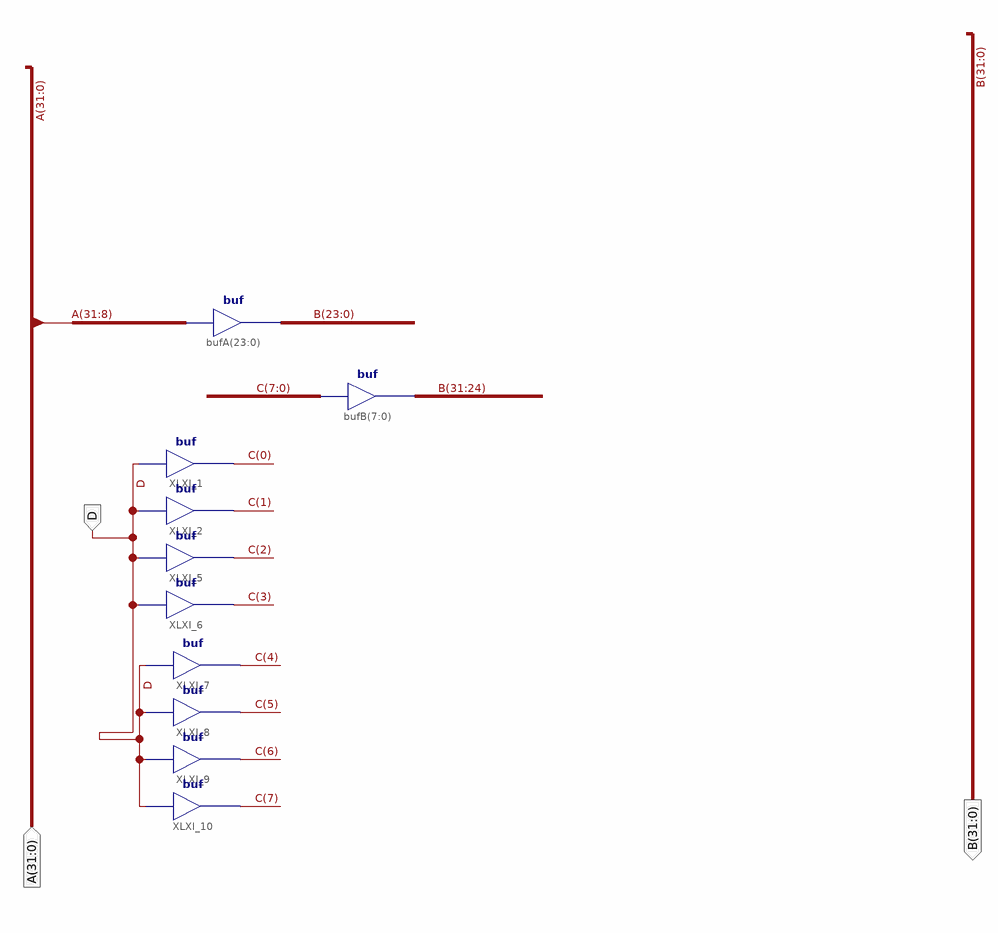
[diagram p0: schematic sheet 1]
// Xilinx ISE schematic shift_8bits.sch (artix7) as structural Verilog: 10 symbols, 3 ports
module shift_8bits (
  input  [31:0] A,
  input  D,
  output [31:0] B
);

  wire [7:0] C;

  assign B[31:24] = C;  // buf bufB[7..0], 8 bits wide
  assign B[23:0] = A[31:8];  // buf bufA[23..0], 24 bits wide
  buf XLXI_1 (C[0], D);
  buf XLXI_2 (C[1], D);
  buf XLXI_5 (C[2], D);
  buf XLXI_6 (C[3], D);
  buf XLXI_7 (C[4], D);
  buf XLXI_8 (C[5], D);
  buf XLXI_9 (C[6], D);
  buf XLXI_10 (C[7], D);
endmodule
